# Altium schematic sheet Flash Memory.SchDoc
size A; SheetNumber: 4; SheetTotal: 4
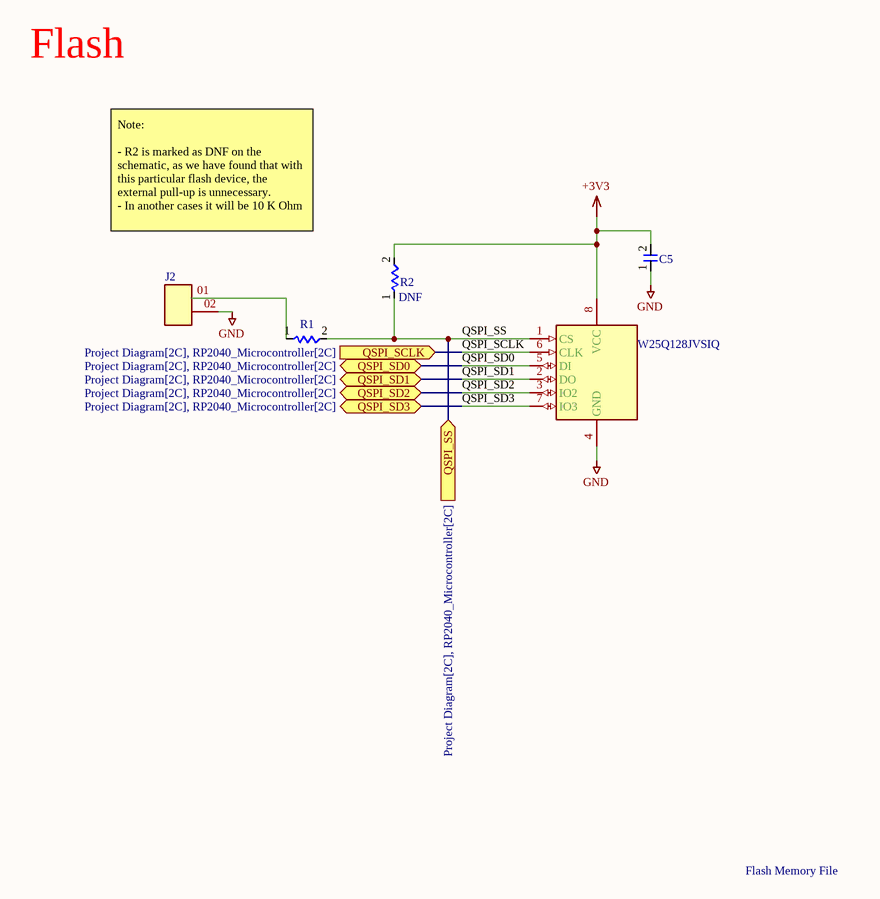
[diagram p0: Flash Memory.SchDoc]

## Parts
C5  10UF Capacitor  [CC0603KRX5R8BB104]  (value not drawn)
J2  Header 1x2  [Header 1x2]  (value not drawn)
R1  1 KOhm  [RC1206FR-078K06L]  (value not drawn)
R2  1 KOhm  [RC1206FR-078K06L]  (value not drawn)
U2  W25Q128JVSIQ  [W25Q128JVSIQ-ND]

## Ports
QSPI_SCLK (in, see Project Diagram[2C], RP2040_Microcontroller[2C]), QSPI_SD0 (bidir, see Project Diagram[2C], RP2040_Microcontroller[2C]), QSPI_SD1 (bidir, see Project Diagram[2C], RP2040_Microcontroller[2C]), QSPI_SD2 (bidir, see Project Diagram[2C], RP2040_Microcontroller[2C]), QSPI_SD3 (bidir, see Project Diagram[2C], RP2040_Microcontroller[2C]), QSPI_SS (in, see Project Diagram[2C], RP2040_Microcontroller[2C])

## Nets
+3V3: C5.2(Pin_2) R2.2(pin_2) U2.8(VCC)
GND: C5.1(Pin_1) J2.02 U2.4(GND)
QSPI_SCLK: U2.6(CLK) ; port QSPI_SCLK
QSPI_SD0: U2.5(DI) ; port QSPI_SD0
QSPI_SD1: U2.2(DO) ; port QSPI_SD1
QSPI_SD2: U2.3(IO2) ; port QSPI_SD2
QSPI_SD3: U2.7(IO3) ; port QSPI_SD3
QSPI_SS: R1.2(pin_2) R2.1(Pin_1) U2.1(CS) ; port QSPI_SS
NetJ2_01: J2.01 R1.1(Pin_1)

## Notes on the sheet
- Flash
- Note:
  - R2 is marked as DNF on the schematic, as we have found that with this particular flash device, the external pull-up is unnecessary.
  - In another cases it will be 10 K Ohm
- (near R2) DNF
- Flash Memory File

## Library data of the parts
C5 = CC0603KRX5R8BB104: 100 nF ±10% 25V Ceramic Capacitor X5R 0603 (1608 Metric); Part Number: CL21A106KOQNNNE; Value: 100nF; Link: https://www.digikey.com/en/products/detail/samsung-electro-mechanics/CL21A106KOQNNNE/3886754; Link1: https://www.digikey.com/en/products/detail/yageo/CC0603KRX5R8BB104/20376210?s=N4IgjCBcoEwAwBYCcVQGMoDMCGAbAzgKYA0IA9lANrhxwAEAdgGIgC6pADgC5QgCqDAJZcA8pgCyhbPgCuAJ0IgAvqQC0ANlQgMkLnJklyVEAGYQpGGyUqQlyNTC1GmOmmwdsaYWTlWgA; Parameter 2: *
R1 R2 = RC1206FR-078K06L: 8.06 kOhms ±1% 0.25W, 1/4W Chip Resistor 1206 (3216 Metric) Moisture Resistant Thick Film; Part Number: RC1206FR-078K06L; Link: https://www.digikey.com/en/products/detail/yageo/RC1206FR-078K06L/729108
U2 = W25Q128JVSIQ: FLASH - NOR Memory IC 128Mbit SPI - Quad I/O, QPI 133 MHz 8-SOIC; Part Number: W25Q128JVSIQ; Link: https://www.digikey.com/en/products/detail/winbond-electronics/W25Q128JVSIQ/5803943